# Altium schematic sheet FPGA_Bank0-1.SchDoc: =DocumentName
size A3; DocumentNumber: 1; Revision: 0; SheetNumber: 15; SheetTotal: 18
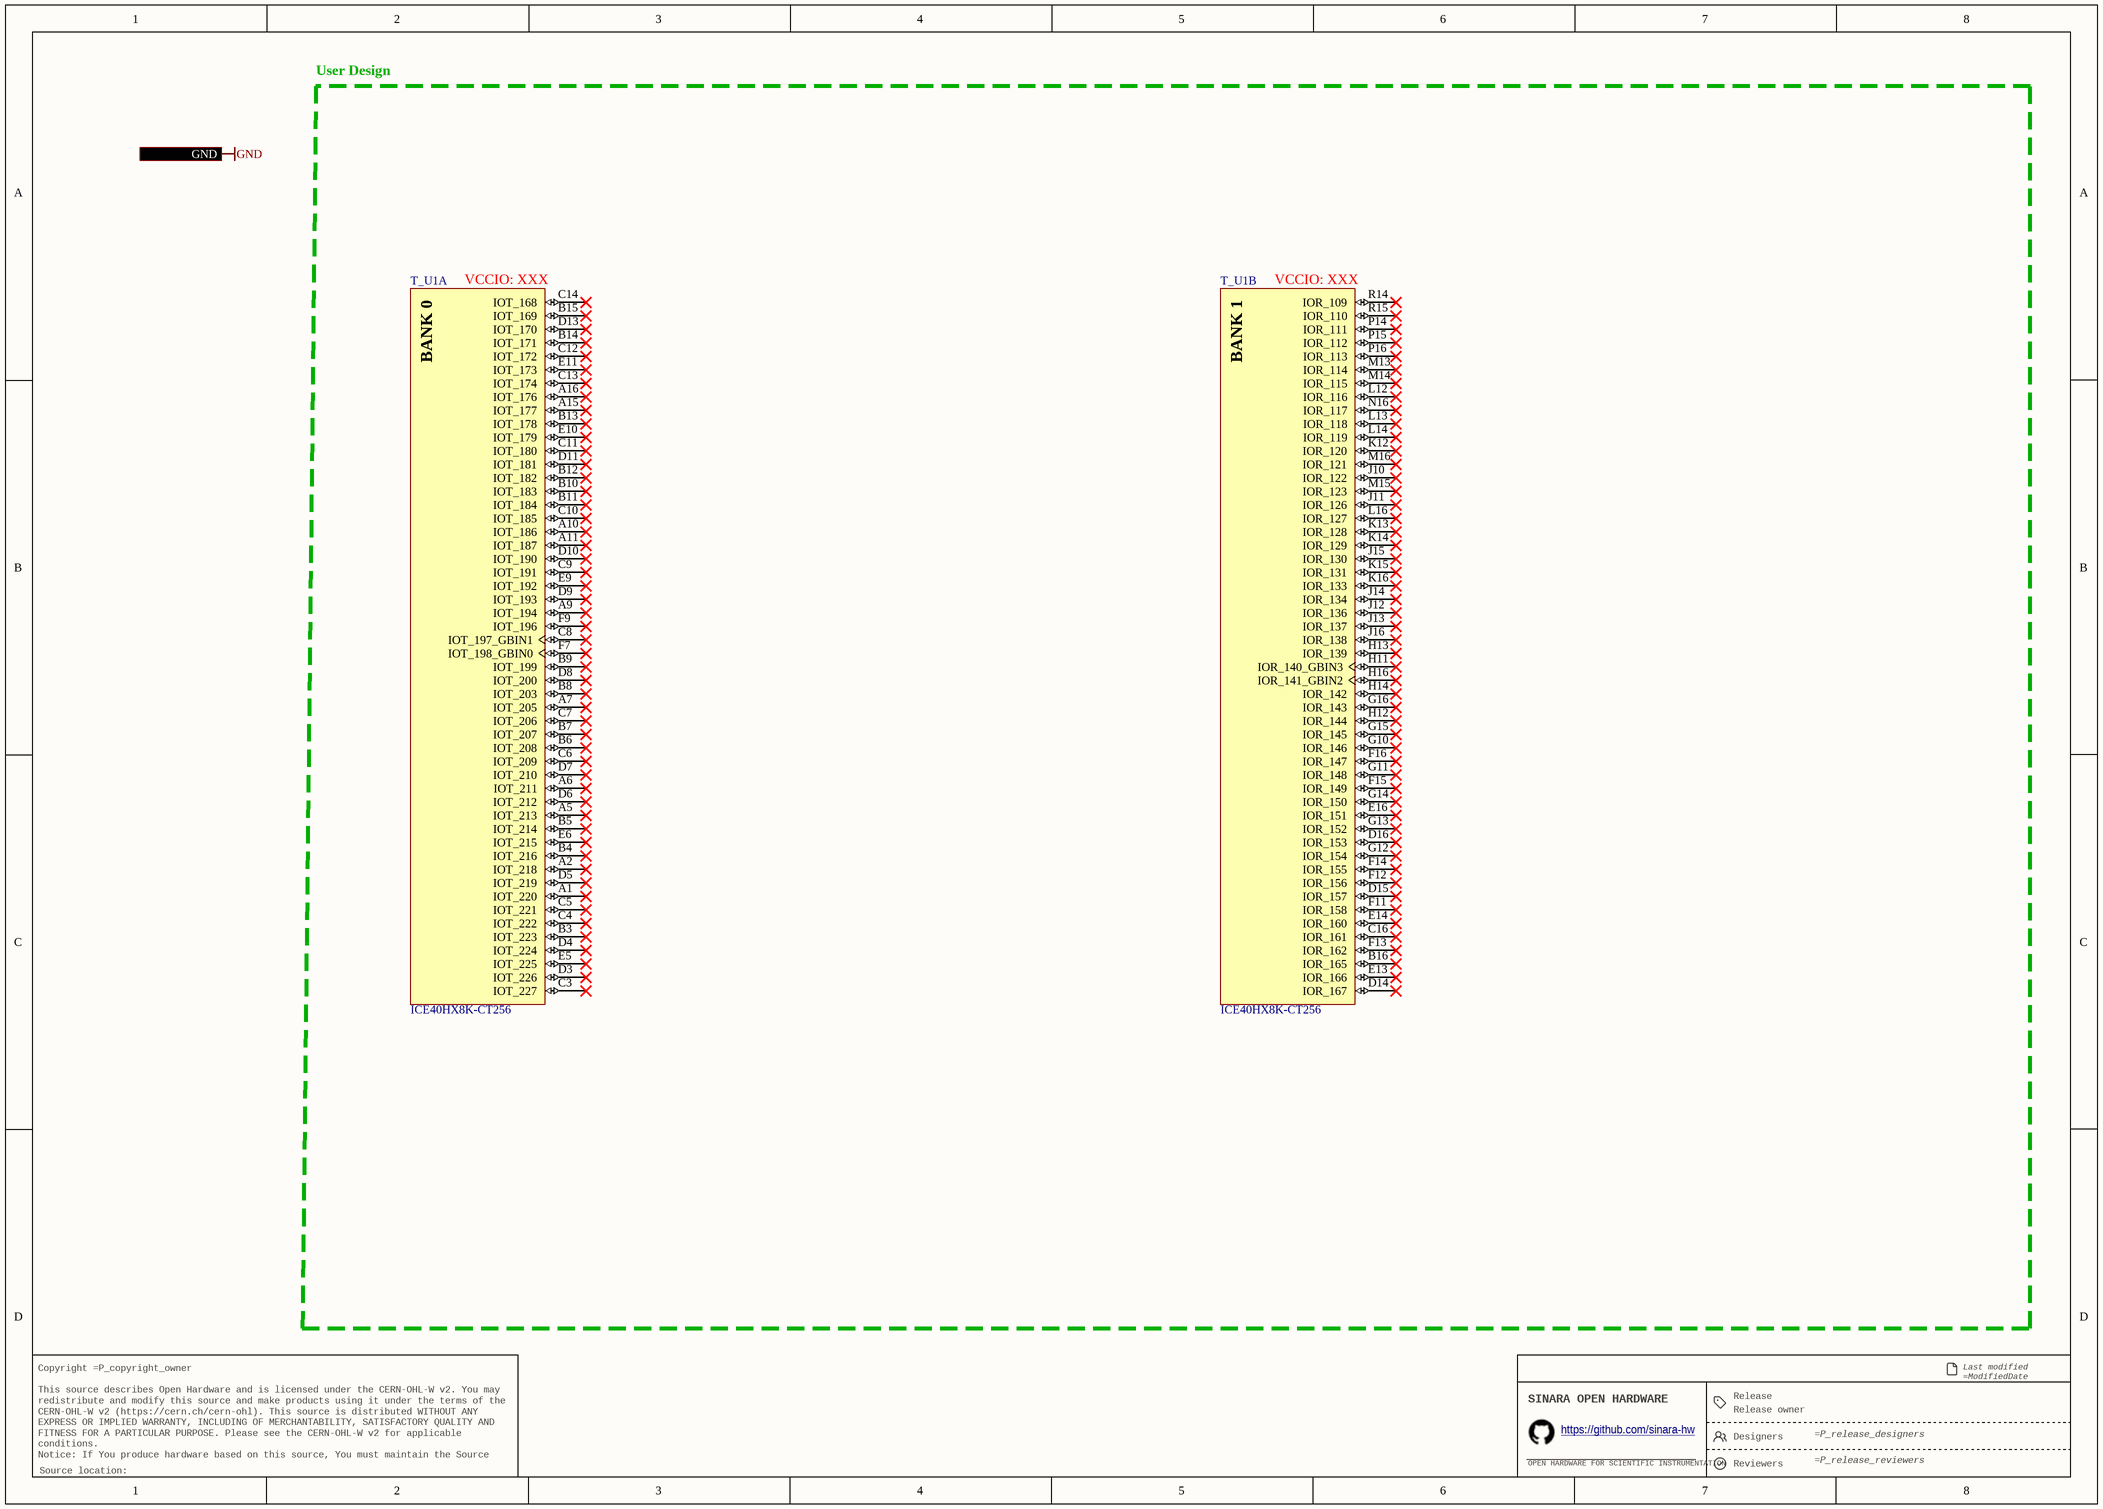
[diagram p0: FPGA_Bank0-1.SchDoc]

## Parts
T_U1  ICE40HX8K-CT256  [LATC-caBGA-256]  (parts A,B of 5)

## Ports
GND

## Nets
GND: port GND

Not connected (* = marked no-connect by the designer): T_U1 A1(IOT_220)* A2(IOT_218)* A5(IOT_213)* A6(IOT_211)* A7(IOT_205)* A9(IOT_194)* A10(IOT_186)* A11(IOT_187)* A15(IOT_177)* A16(IOT_176)* B3(IOT_223)* B4(IOT_216)* B5(IOT_214)* B6(IOT_208)* B7(IOT_207)* B8(IOT_203)* B9(IOT_199)* B10(IOT_183)* B11(IOT_184)* B12(IOT_182)* B13(IOT_178)* B14(IOT_171)* B15(IOT_169)* B16(IOR_165)* C3(IOT_227)* C4(IOT_222)* C5(IOT_221)* C6(IOT_209)* C7(IOT_206)* C8(IOT_197_GBIN1)* C9(IOT_191)* C10(IOT_185)* C11(IOT_180)* C12(IOT_172)* C13(IOT_174)* C14(IOT_168)* C16(IOR_161)* D3(IOT_226)* D4(IOT_224)* D5(IOT_219)* D6(IOT_212)* D7(IOT_210)* D8(IOT_200)* D9(IOT_193)* D10(IOT_190)* D11(IOT_181)* D13(IOT_170)* D14(IOR_167)* D15(IOR_157)* D16(IOR_153)* E5(IOT_225)* E6(IOT_215)* E9(IOT_192)* E10(IOT_179)* E11(IOT_173)* E13(IOR_166)* E14(IOR_160)* E16(IOR_151)* F7(IOT_198_GBIN0)* F9(IOT_196)* F11(IOR_158)* F12(IOR_156)* F13(IOR_162)* F14(IOR_155)* F15(IOR_149)* F16(IOR_147)* G10(IOR_146)* G11(IOR_148)* G12(IOR_154)* G13(IOR_152)* G14(IOR_150)* G15(IOR_145)* G16(IOR_143)* H11(IOR_140_GBIN3)* H12(IOR_144)* H13(IOR_139)* H14(IOR_142)* H16(IOR_141_GBIN2)* J10(IOR_122)* J11(IOR_126)* J12(IOR_136)* J13(IOR_137)* J14(IOR_134)* J15(IOR_130)* J16(IOR_138)* K12(IOR_120)* K13(IOR_128)* K14(IOR_129)* K15(IOR_131)* K16(IOR_133)* L12(IOR_116)* L13(IOR_118)* L14(IOR_119)* L16(IOR_127)* M13(IOR_114)* M14(IOR_115)* M15(IOR_123)* M16(IOR_121)* N16(IOR_117)* P14(IOR_111)* P15(IOR_112)* P16(IOR_113)* R14(IOR_109)* R15(IOR_110)*

## Notes on the sheet
- User Design
- (near T_U1) VCCIO: XXX
- Release
- Last modified =ModifiedDate
  Sheet =sheetnumber of =sheettotal · Size A3
- Copyright =P_copyright_owner
  This source describes Open Hardware and is licensed under the CERN-OHL-W v2. You may redistribute and modify this source and make products using it under the terms of the CERN-OHL-W v2 (https://cern.ch/cern-ohl). This source is distributed WITHOUT ANY EXPRESS OR IMPLIED WARRANTY, INCLUDING OF MERCHANTABILITY, SATISFACTORY QUALITY AND FITNESS FOR A PARTICULAR PURPOSE. Please see the CERN-OHL-W v2 for applicable conditions.
  Notice: If You produce hardware based on this source, You must maintain the Source Location visible on the product, its packaging or its documentation.
- SINARA OPEN HARDWARE
- OPEN HARDWARE FOR SCIENTIFIC INSTRUMENTATION
- https://github.com/sinara-hw
- Release owner
- Designers
- Reviewers
- Source location:
- (in symbol CMP-0962-00001-1, part A) BANK 0
- (in symbol CMP-0962-00001-1, part B) BANK 1

## Library data of the parts
T_U1 = CMP-0962-00001-1: iCE40 HX8K Series FPGA Family, 7680 Logic Cells, 1.2 V Core, 128 K Embedded RAM Bits, 256-ball caBGA, Pb-Free, Tray; Manufacturer: Lattice Semiconductor; Supply Voltage: 1.2V; Phase-Locked Loops: 2; Logic Cells: 7680; Embedded RAM Bits: 128K; PackageReference: caBGA-256; PackageDescription: 256-Ball Chip Array Ball Grid Array, Body 14 x 14 mm, Pitch 0.8 mm; RoHS: TRUE; Packing: Tray; Mounting Technology: Surface Mount; ComponentLink3URL: http://www.latticesemi.com/lit/docs/package/pkg.pdf; ComponentLink1Description: Manufacturer URL; ComponentLink3Description: Package Specification; Code_JEDEC: MO-275; PackageVersion: Rev. 03.9, 02/2013; ComponentLink1URL: http://www.latticesemi.com/en; ComponentLink2URL: http://www.latticesemi.com/~/media/Documents/DataSheets/iCE/iCE40LPHXFamilyDataSheet.pdf; Manufacturer Part Number: ICE40HX8K-CT256; ComponentLink2Description: Datasheet; DatasheetVersion: Rev. 02.9